# Altium schematic sheet MCU.SchDoc
size A4
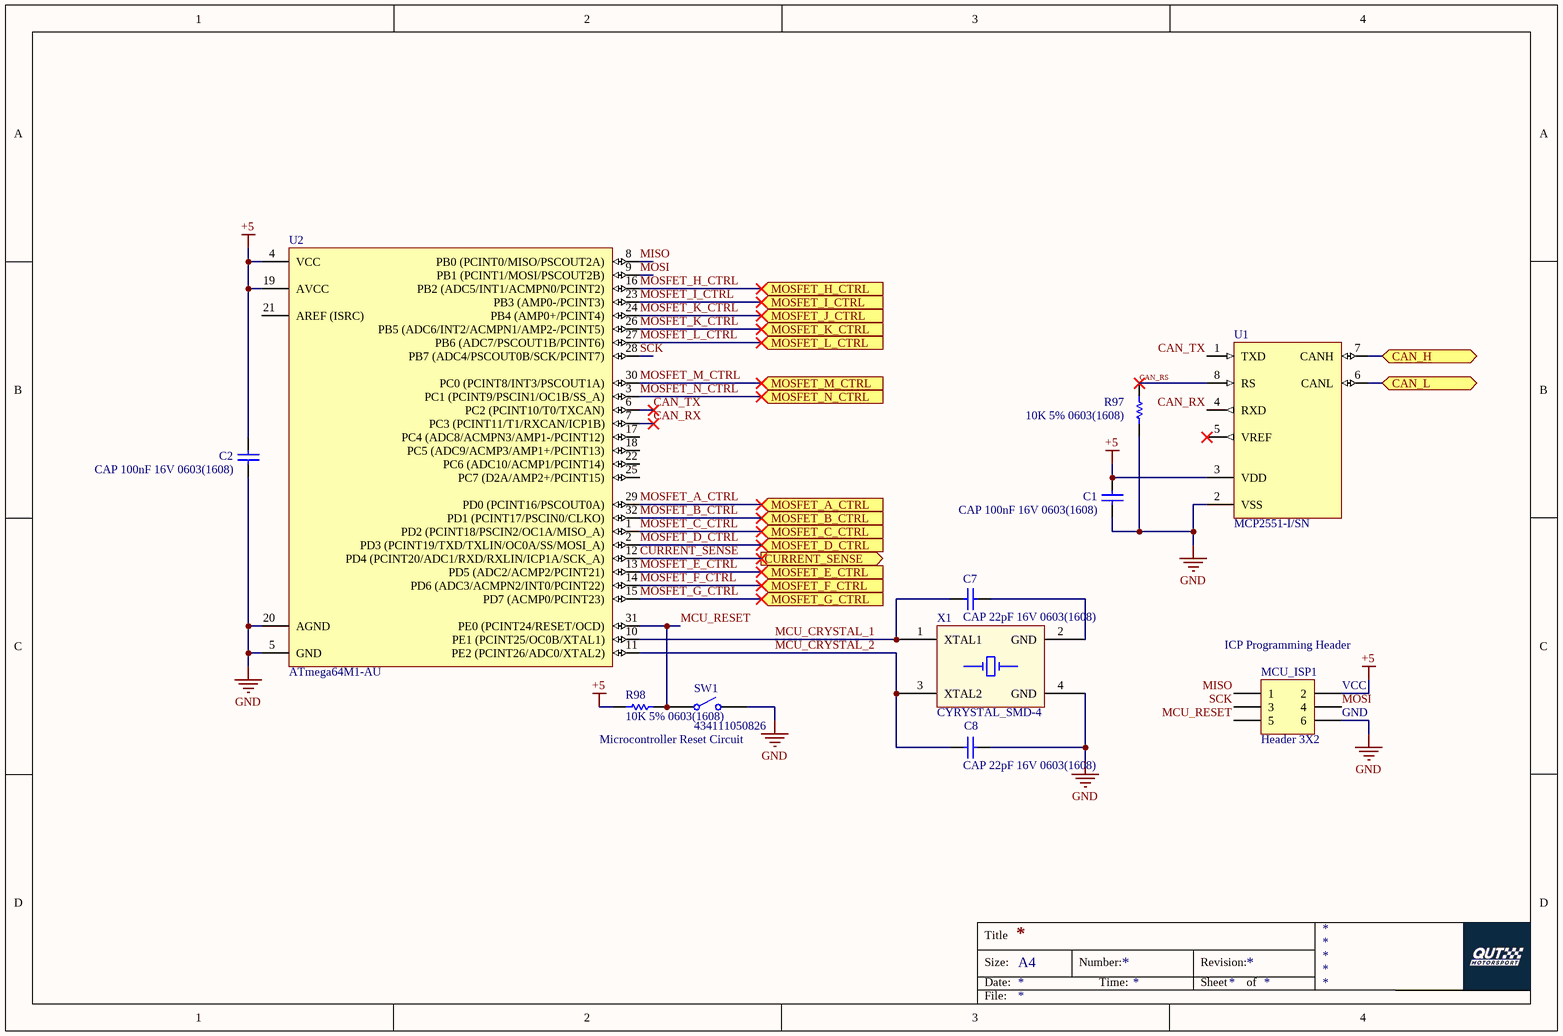
[diagram p0: MCU.SchDoc]

## Parts
C1  CAP 100nF 16V 0603(1608)  [CAPC0603(1608)100_M]
C2  CAP 100nF 16V 0603(1608)  [CAPC0603(1608)100_M]
C7  CAP 22pF 16V 0603(1608)  [CAPC0603(1608)100_N]
C8  CAP 22pF 16V 0603(1608)  [CAPC0603(1608)100_N]
MCU_ISP1  Header 3X2  [HDR2X3]
R97  10K 5% 0603(1608)  [RESC0603(1608)_N]
R98  10K 5% 0603(1608)  [RESC0603(1608)_N]
SW1  434111050826  [434111050826]
U1  MCP2551-I/SN  [SOIC-SN8_N]
U2  ATmega64M1-AU  [32A_L]
X1  CYRYSTAL_SMD-4  [SMD-4_CRYSTAL_5x3.2mm]

## Ports
CAN_H (bidir), CAN_L (bidir), CURRENT_SENSE (out), MOSFET_A_CTRL (in), MOSFET_B_CTRL (in), MOSFET_C_CTRL (in), MOSFET_D_CTRL (in), MOSFET_E_CTRL (in), MOSFET_F_CTRL (in), MOSFET_G_CTRL (in), MOSFET_H_CTRL (in), MOSFET_I_CTRL (in), MOSFET_J_CTRL (in), MOSFET_K_CTRL (in), MOSFET_L_CTRL (in), MOSFET_M_CTRL (in), MOSFET_N_CTRL (in)

## Nets
+5: C1.2 C2.2 MCU_ISP1.2 R98.2 U1.3(VDD) U2.4(VCC) U2.19(AVCC)
GND: C1.1 C2.1 C8.2 MCU_ISP1.6 R97.1 SW1.2 U1.2(VSS) U2.5(GND) U2.20(AGND) X1.4(GND)
CAN_H: U1.7(CANH) ; port CAN_H
CAN_L: U1.6(CANL) ; port CAN_L
CAN_RS: R97.2 U1.8(RS)
CAN_RX: U1.4(RXD) U2.7(PC3_(PCINT11/T1/RXCAN/ICP1B))
CAN_TX: U1.1(TXD) U2.6(PC2_(PCINT10/T0/TXCAN))
CURRENT_SENSE: U2.12(PD4_(PCINT20/ADC1/RXD/RXLIN/ICP1A/SCK_A)) ; port CURRENT_SENSE
MCU_CRYSTAL_1: C7.1 U2.10(PE1_(PCINT25/OC0B/XTAL1)) X1.1(XTAL1)
MCU_CRYSTAL_2: C8.1 U2.11(PE2_(PCINT26/ADC0/XTAL2)) X1.3(XTAL2)
MCU_RESET: MCU_ISP1.5 R98.1 SW1.1 U2.31(PE0_(PCINT24/RESET/OCD))
MISO: MCU_ISP1.1 U2.8(PB0_(PCINT0/MISO/PSCOUT2A))
MOSFET_A_CTRL: U2.29(PD0_(PCINT16/PSCOUT0A)) ; port MOSFET_A_CTRL
MOSFET_B_CTRL: U2.32(PD1_(PCINT17/PSCIN0/CLKO)) ; port MOSFET_B_CTRL
MOSFET_C_CTRL: U2.1(PD2_(PCINT18/PSCIN2/OC1A/MISO_A)) ; port MOSFET_C_CTRL
MOSFET_D_CTRL: U2.2(PD3_(PCINT19/TXD/TXLIN/OC0A/SS/MOSI_A)) ; port MOSFET_D_CTRL
MOSFET_E_CTRL: U2.13(PD5_(ADC2/ACMP2/PCINT21)) ; port MOSFET_E_CTRL
MOSFET_F_CTRL: U2.14(PD6_(ADC3/ACMPN2/INT0/PCINT22)) ; port MOSFET_F_CTRL
MOSFET_G_CTRL: U2.15(PD7_(ACMP0/PCINT23)) ; port MOSFET_G_CTRL
MOSFET_H_CTRL: U2.16(PB2_(ADC5/INT1/ACMPN0/PCINT2)) ; port MOSFET_H_CTRL
MOSFET_I_CTRL: U2.23(PB3_(AMP0-/PCINT3)) ; port MOSFET_I_CTRL
MOSFET_K_CTRL: U2.24(PB4_(AMP0+/PCINT4)) U2.26(PB5_(ADC6/INT2/ACMPN1/AMP2-/PCINT5)) ; port MOSFET_J_CTRL, port MOSFET_K_CTRL
MOSFET_L_CTRL: U2.27(PB6_(ADC7/PSCOUT1B/PCINT6)) ; port MOSFET_L_CTRL
MOSFET_M_CTRL: U2.30(PC0_(PCINT8/INT3/PSCOUT1A)) ; port MOSFET_M_CTRL
MOSFET_N_CTRL: U2.3(PC1_(PCINT9/PSCIN1/OC1B/SS_A)) ; port MOSFET_N_CTRL
MOSI: MCU_ISP1.4 U2.9(PB1_(PCINT1/MOSI/PSCOUT2B))
SCK: MCU_ISP1.3 U2.28(PB7_(ADC4/PSCOUT0B/SCK/PCINT7))
NetC7_2: C7.2 X1.2(GND)

Not connected (* = marked no-connect by the designer): U1 5(VREF)*; U2 17(PC4_(ADC8/ACMPN3/AMP1-/PCINT12)) 18(PC5_(ADC9/ACMP3/AMP1+/PCINT13)) 21(AREF_(ISRC)) 22(PC6_(ADC10/ACMP1/PCINT14)) 25(PC7_(D2A/AMP2+/PCINT15))

## Notes on the sheet
- (near MCU_ISP1) ICP Programming Header
- (near MCU_ISP1) VCC
- (near MCU_ISP1) GND
- Microcontroller Reset Circuit
- Title
- Size:
- Date:
- A4
- Number:
- Time:
- Revision:
- Sheet
- of
- File:

## Library data of the parts
C1 C2 = CMP-1035-02583-1: CAP 100nF 16V ±5% 0603 (1608 Metric) Thickness 1mm SMD; Tolerance: Â±5%; Case-Metric: 1608; Case-EIA: 0603; Rated Voltage: 16 V; Max Thickness: 1 mm; Technology: SMT; Value: 100nF
C7 C8 = CMP-1035-00808-1: CAP 22pF 16V ±5% 0603 (1608 Metric) Thickness 1mm SMD; Tolerance: Â±5%; Case-EIA: 0603; Case-Metric: 1608; Technology: SMT; Value: 22pF; Rated Voltage: 16 V; Max Thickness: 1 mm
MCU_ISP1 = Header 3X2: Header, 3-Pin, Dual row; LatestRevisionDate: 17-Jul-2002; LatestRevisionNote: Re-released for DXP Platform.; Publisher: Altium Limited
R97 R98 = CMP-1012-00098-1: 10K 0.1W 5% 0603 (1608 Metric)  SMD; Case-EIA: 0603; Value: 10000.00 Ohm; Case-Metric: 1608; Technology: SMT; Tolerance: 5 %; Power: 0.1 W
SW1 = CMP-1459-00003-1: WS-TASV SMD Tact Switch 6.0X3.5 mm; Manufacturer: Wuerth Elektronik; NoPins: 02; ComponentLink2URL: http://katalog.we-online.de/em/datasheet/434111050826.pdf; PackageReference: 434111050826; ComponentLink2Description: Datasheet; PartNumber: 434111050826; ComponentLink1URL: http://www.we-online.com; ComponentLink1Description: Manufacturer URL
U1 = CMP-0186-00138-2: High-Speed CAN Transceiver, 8-Pin SOIC, Industrial Temperature; Code_JEDEC: MS-012; ComponentLink3URL: http://www.microchip.com/stellent/groups/techpub_sg/documents/packagingspec/en012702.pdf; DatasheetVersion: revF, Jul-2010; PackageVersion: revBB, Aug-2009; PackageDescription: 8-Lead Plastic Small Outline (SN) - Narrow, 3.90mm Body [SOIC]; ComponentLink1URL: http://www.microchip.com/; ComponentLink3Description: Package Specification; ComponentLink2Description: Datasheet; Code_IPC: SOIC127P600-8; ComponentLink1Description: Manufacturer URL; PackageReference: SOIC-SN8; ComponentLink2URL: http://ww1.microchip.com/downloads/en/DeviceDoc/21667F.pdf; RevisionNote: URLs added. DatasheetVersion updated.
U2 = CMP-0096-00131-2: 8-bit AVR Microcontroller, 2.7-5.5V, 16MHz, 64KB Flash, 2KB EEPROM, 4KB SRAM, Industrial Grade (-40° to +85°C), 32-Pin TQFP; Code_JEDEC: MS-026-ABA; PackageVersion: revC, Oct-2010; ComponentLink2Description: ATmega16M1/32M1/64M1 Datasheet; ComponentLink1Description: Manufacturer URL; DatasheetVersion: revD, Nov-2010; ComponentLink3Description: ATmega16M1/32M1/64M1 Summary; ComponentLink1URL: http://www.atmel.com/; RevisionNote: DatasheetVersion & PackageVersion updated. URLs added.; PackageReference: 32A; ComponentLink3URL: http://www.atmel.com/dyn/resources/prod_documents/8209S.pdf; PackageDescription: 32-Lead, 7x7x1.0 mm Body, 0.8mm Lead Pitch, Thin Profile Plastic Quad Flat Package (TQFP); ComponentLink2URL: http://www.atmel.com/dyn/resources/prod_documents/doc8209.pdf